# EAGLE schematic Apex_CV_Inputs_UI_v1.0 (EAGLE 9.5.2)
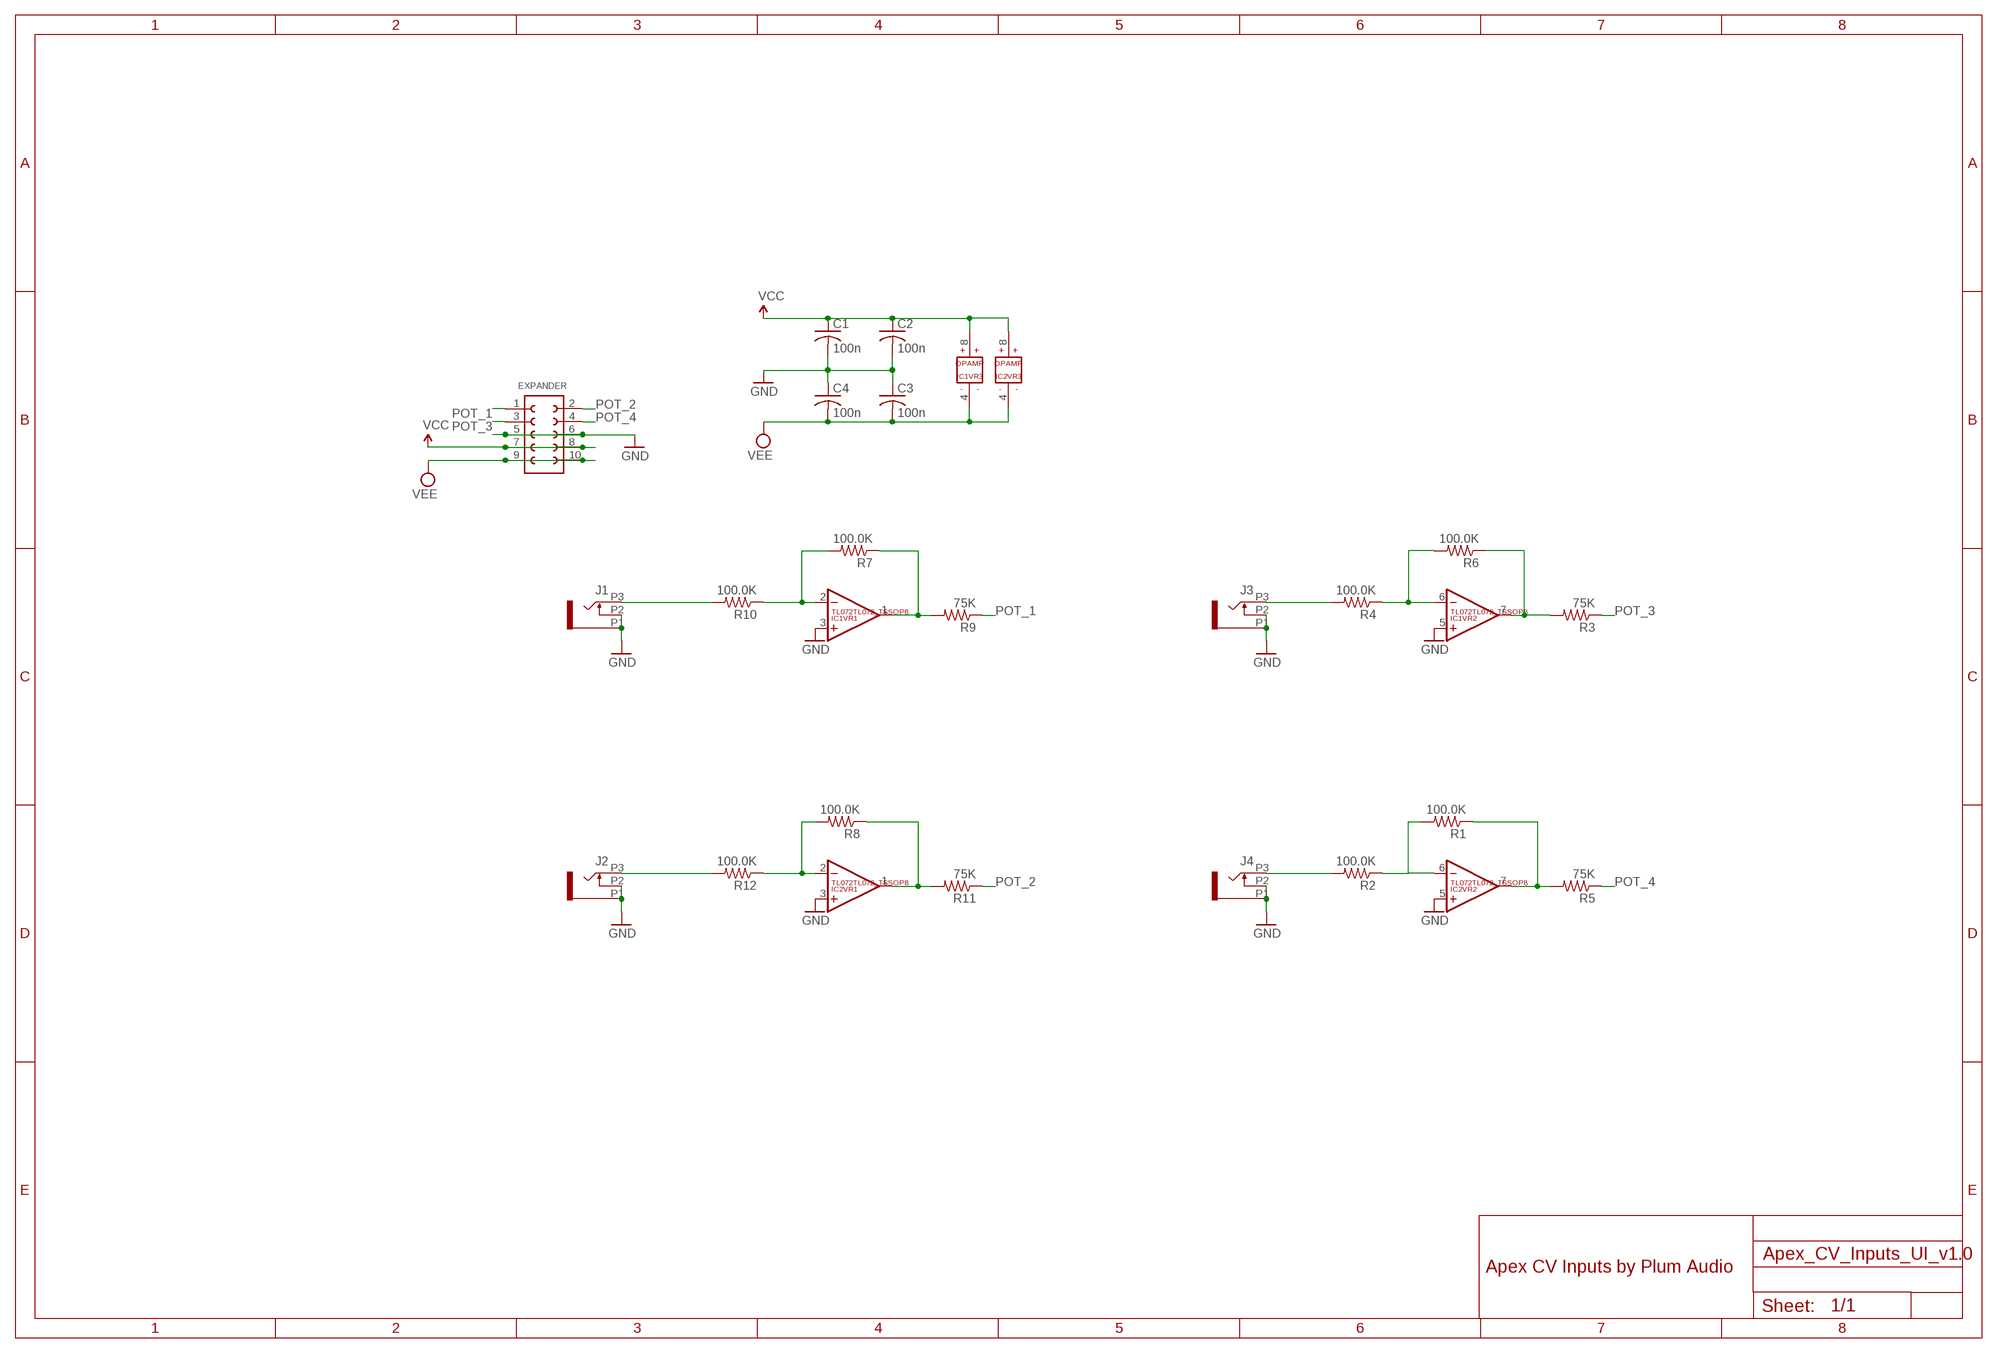
[diagram p0: schematic, sheet 1]

## Parts
C1  100n  C-USC0603  [C0603]
C2  100n  C-USC0603  [C0603]
C3  100n  C-USC0603  [C0603]
C4  100n  C-USC0603  [C0603]
EXPANDER  61301021121  [61301021121]
IC1  TL072TL072_TSSOP8  [TL072_TSSOP8]
IC2  TL072TL072_TSSOP8  [TL072_TSSOP8]
J1  OG-PJ301_PJ301_THONKICONN  [OG-PJ301_WQP_PJ_301M6_NO_HOLE]
J2  OG-PJ301_PJ301_THONKICONN  [OG-PJ301_WQP_PJ_301M6_NO_HOLE]
J3  OG-PJ301_PJ301_THONKICONN  [OG-PJ301_WQP_PJ_301M6_NO_HOLE]
J4  OG-PJ301_PJ301_THONKICONN  [OG-PJ301_WQP_PJ_301M6_NO_HOLE]
R1  100.0K  R-US_R0603  [R0603]
R2  100.0K  R-US_R0603  [R0603]
R3  75K  R-US_R0603  [R0603]
R4  100.0K  R-US_R0603  [R0603]
R5  75K  R-US_R0603  [R0603]
R6  100.0K  R-US_R0603  [R0603]
R7  100.0K  R-US_R0603  [R0603]
R8  100.0K  R-US_R0603  [R0603]
R9  75K  R-US_R0603  [R0603]
R10  100.0K  R-US_R0603  [R0603]
R11  75K  R-US_R0603  [R0603]
R12  100.0K  R-US_R0603  [R0603]

## Nets
GND: C1.2 C2.2 C3.1 C4.1 EXPANDER.5 EXPANDER.6 IC1.3(VR1:+IN) IC1.5(VR2:+IN) IC2.3(VR1:+IN) IC2.5(VR2:+IN) J1.P1 J1.P2 J2.P1 J2.P2 J3.P1 J3.P2 J4.P1 J4.P2
N$1: J1.P3 R10.2
N$2: IC1.2(VR1:-IN) R7.2 R10.1
N$3: IC2.2(VR1:-IN) R8.2 R12.1
N$4: IC2.1(VR1:OUT) R8.1 R11.2
N$6: IC1.1(VR1:OUT) R7.1 R9.2
N$7: J2.P3 R12.2
N$9: IC1.6(VR2:-IN) R4.1 R6.2
N$10: IC2.6(VR2:-IN) R1.2 R2.1
N$11: IC2.7(VR2:OUT) R1.1 R5.2
N$13: J3.P3 R4.2
N$14: IC1.7(VR2:OUT) R3.2 R6.1
N$19: J4.P3 R2.2
POT_1: EXPANDER.1 R9.1
POT_2: EXPANDER.2 R11.1
POT_3: EXPANDER.3 R3.1
POT_4: EXPANDER.4 R5.1
VCC: C1.1 C2.1 EXPANDER.7 EXPANDER.8 IC1.8(VR3:V+) IC2.8(VR3:V+)
VEE: C3.2 C4.2 EXPANDER.9 EXPANDER.10 IC1.4(VR3:V-) IC2.4(VR3:V-)

## Notes on the sheet
- Apex CV Inputs by Plum Audio

## Library data of the parts
C1-C4 = rcl:C-US: CAPACITOR, American symbol
EXPANDER = Wurth_Elektronik_Electromechanic_Board_to_Board_Connectors_rev18b:61301021121: WR-PHD 2.54mm Dual Pin Header, 10 Pins =>Code : Con_BTB_PHD_2.54_2_61301021121 <http://katalog.we-online.de/media/images/eican/Con_BTB_PHD_2.54_2_6130xx21121_pf2.jpg> Details see: http://katalog.we-online.de/en/em/613_0xx_211_21 Created 2014-05-29, Karrer Zheng 2014 (C) Würth Elektronik
IC1 IC2 = EurorackModularParts:TL072
J1-J4 = SHAY_THONKICONNS:OG-PJ301_PJ301_THONKICONN
R1-R12 = rcl:R-US_: RESISTOR, American symbol